# Altium schematic sheet Amplify.SchDoc
size A4; SheetNumber: 2; SheetTotal: 5
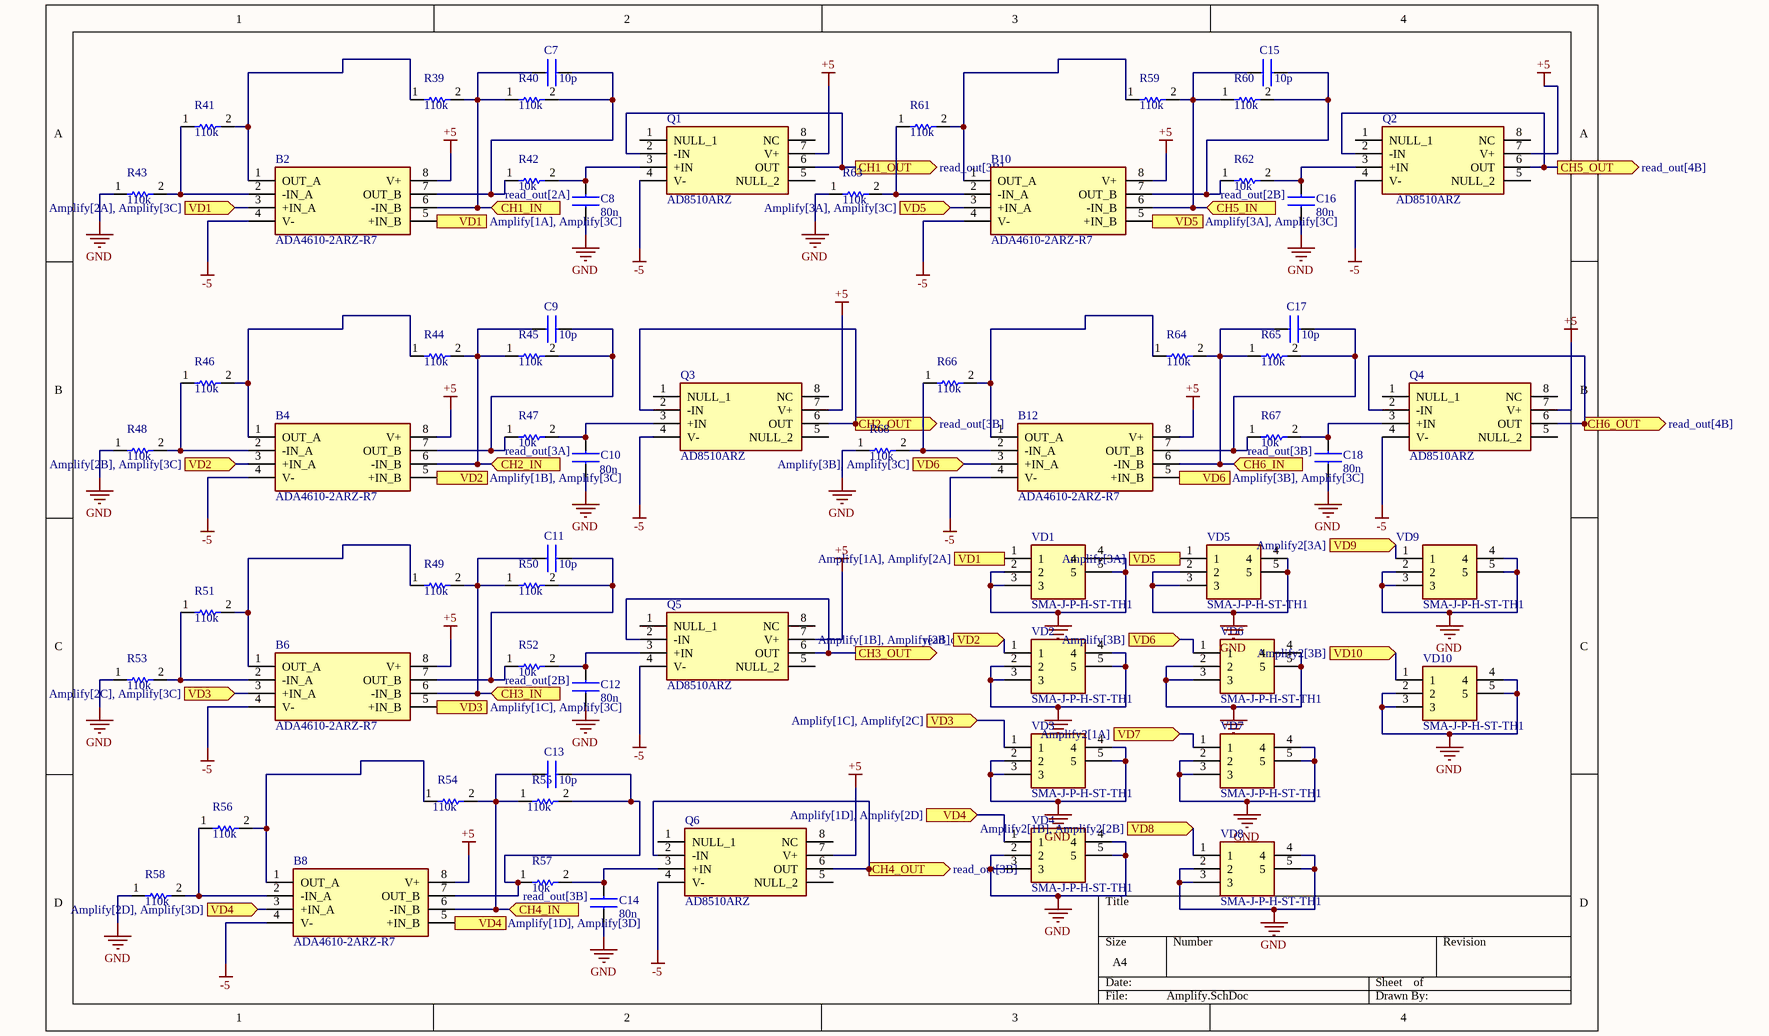
[diagram p0: Amplify.SchDoc]

## Parts
B2  ADA4610-2ARZ-R7  [SOIC127P600X175-8N]
B4  ADA4610-2ARZ-R7  [SOIC127P600X175-8N]
B6  ADA4610-2ARZ-R7  [SOIC127P600X175-8N]
B8  ADA4610-2ARZ-R7  [SOIC127P600X175-8N]
B10  ADA4610-2ARZ-R7  [SOIC127P600X175-8N]
B12  ADA4610-2ARZ-R7  [SOIC127P600X175-8N]
C7  10p  [0805X7R106KT1AT]
C8  80n  [0805X7R106KT1AT]
C9  10p  [0805X7R106KT1AT]
C10  80n  [0805X7R106KT1AT]
C11  10p  [0805X7R106KT1AT]
C12  80n  [0805X7R106KT1AT]
C13  10p  [0805X7R106KT1AT]
C14  80n  [0805X7R106KT1AT]
C15  10p  [0805X7R106KT1AT]
C16  80n  [0805X7R106KT1AT]
C17  10p  [0805X7R106KT1AT]
C18  80n  [0805X7R106KT1AT]
Q1  AD8510ARZ  [AD8510ARZ]
Q2  AD8510ARZ  [AD8510ARZ]
Q3  AD8510ARZ  [AD8510ARZ]
Q4  AD8510ARZ  [AD8510ARZ]
Q5  AD8510ARZ  [AD8510ARZ]
Q6  AD8510ARZ  [AD8510ARZ]
R39  110k  [CR0805-FX-1543ELF]
R40  110k  [CR0805-FX-1543ELF]
R41  110k  [CR0805-FX-1543ELF]
R42  10k  [CR0805-FX-1543ELF]
R43  110k  [CR0805-FX-1543ELF]
R44  110k  [CR0805-FX-1543ELF]
R45  110k  [CR0805-FX-1543ELF]
R46  110k  [CR0805-FX-1543ELF]
R47  10k  [CR0805-FX-1543ELF]
R48  110k  [CR0805-FX-1543ELF]
R49  110k  [CR0805-FX-1543ELF]
R50  110k  [CR0805-FX-1543ELF]
R51  110k  [CR0805-FX-1543ELF]
R52  10k  [CR0805-FX-1543ELF]
R53  110k  [CR0805-FX-1543ELF]
R54  110k  [CR0805-FX-1543ELF]
R55  110k  [CR0805-FX-1543ELF]
R56  110k  [CR0805-FX-1543ELF]
R57  10k  [CR0805-FX-1543ELF]
R58  110k  [CR0805-FX-1543ELF]
R59  110k  [CR0805-FX-1543ELF]
R60  110k  [CR0805-FX-1543ELF]
R61  110k  [CR0805-FX-1543ELF]
R62  10k  [CR0805-FX-1543ELF]
R63  110k  [CR0805-FX-1543ELF]
R64  110k  [CR0805-FX-1543ELF]
R65  110k  [CR0805-FX-1543ELF]
R66  110k  [CR0805-FX-1543ELF]
R67  10k  [CR0805-FX-1543ELF]
R68  110k  [CR0805-FX-1543ELF]
VD1  SMA-J-P-H-ST-TH1  [SMAJPHSTTH1]
VD2  SMA-J-P-H-ST-TH1  [SMAJPHSTTH1]
VD3  SMA-J-P-H-ST-TH1  [SMAJPHSTTH1]
VD4  SMA-J-P-H-ST-TH1  [SMAJPHSTTH1]
VD5  SMA-J-P-H-ST-TH1  [SMAJPHSTTH1]
VD6  SMA-J-P-H-ST-TH1  [SMAJPHSTTH1]
VD7  SMA-J-P-H-ST-TH1  [SMAJPHSTTH1]
VD8  SMA-J-P-H-ST-TH1  [SMAJPHSTTH1]
VD9  SMA-J-P-H-ST-TH1  [SMAJPHSTTH1]
VD10  SMA-J-P-H-ST-TH1  [SMAJPHSTTH1]

## Ports
CH1_IN (in, see read_out[2A]), CH1_OUT (out, see read_out[3B]), CH2_IN (in, see read_out[3A]), CH2_OUT (out, see read_out[3B]), CH3_IN (in, see read_out[2B]), CH3_OUT (out, see read_out[3B]), CH4_IN (in, see read_out[3B]), CH4_OUT (out, see read_out[3B]), CH5_IN (in, see read_out[2B]), CH5_OUT (out, see read_out[4B]), CH6_IN (in, see read_out[3B]), CH6_OUT (out, see read_out[4B]), VD1 (in, see Amplify[1A], Amplify[2A]), VD1 (in, see Amplify[1A], Amplify[3C]), VD1 (in, see Amplify[2A], Amplify[3C]), VD2 (in, see Amplify[1B], Amplify[2B]), VD2 (in, see Amplify[1B], Amplify[3C]), VD2 (in, see Amplify[2B], Amplify[3C]), VD3 (in, see Amplify[1C], Amplify[2C]), VD3 (in, see Amplify[1C], Amplify[3C]), VD3 (in, see Amplify[2C], Amplify[3C]), VD4 (in, see Amplify[1D], Amplify[2D]), VD4 (in, see Amplify[1D], Amplify[3D]), VD4 (in, see Amplify[2D], Amplify[3D]), VD5 (in, see Amplify[3A]), VD5 (in, see Amplify[3A], Amplify[3C]), VD6 (in, see Amplify[3B]), VD6 (in, see Amplify[3B], Amplify[3C]), VD7 (in, see Amplify2[1A]), VD8 (in, see Amplify2[1B], Amplify2[2B]), VD9 (in, see Amplify2[3A]), VD10 (in, see Amplify2[3B])

## Nets
+5: B2.8(V+) B4.8(V+) B6.8(V+) B8.8(V+) B10.8(V+) B12.8(V+) Q1.7(V+) Q2.7(V+) Q3.7(V+) Q4.7(V+) Q5.7(V+) Q6.7(V+)
-5: B2.4(V-) B4.4(V-) B6.4(V-) B8.4(V-) B10.4(V-) B12.4(V-) Q1.4(V-) Q2.4(V-) Q3.4(V-) Q4.4(V-) Q5.4(V-) Q6.4(V-)
GND: C8.2 C10.2 C12.2 C14.2 C16.2 C18.2 R43.1 R48.1 R53.1 R58.1 R63.1 R68.1 VD1.2 VD1.3 VD1.4 VD1.5 VD2.2 VD2.3 VD2.4 VD2.5 VD3.2 VD3.3 VD3.4 VD3.5 VD4.2 VD4.3 VD4.4 VD4.5 VD5.2 VD5.3 VD5.4 VD5.5 VD6.2 VD6.3 VD6.4 VD6.5 VD7.2 VD7.3 VD7.4 VD7.5 VD8.2 VD8.3 VD8.4 VD8.5 VD9.2 VD9.3 VD9.4 VD9.5 VD10.2 VD10.3 VD10.4 VD10.5
CH1_IN: B2.6(-IN_B) C7.1 R39.2 R40.1 ; port CH1_IN
CH1_OUT: Q1.2(-IN) Q1.6(OUT) ; port CH1_OUT
CH2_IN: B4.6(-IN_B) C9.1 R44.2 R45.1 ; port CH2_IN
CH2_OUT: Q3.2(-IN) Q3.6(OUT) ; port CH2_OUT
CH3_IN: B6.6(-IN_B) C11.1 R49.2 R50.1 ; port CH3_IN
CH3_OUT: Q5.2(-IN) Q5.6(OUT) ; port CH3_OUT
CH4_IN: B8.6(-IN_B) C13.1 R54.2 R55.1 ; port CH4_IN
CH4_OUT: Q6.2(-IN) Q6.6(OUT) ; port CH4_OUT
CH5_IN: B10.6(-IN_B) C15.1 R59.2 R60.1 ; port CH5_IN
CH5_OUT: Q2.2(-IN) Q2.6(OUT) ; port CH5_OUT
CH6_IN: B12.6(-IN_B) C17.1 R64.2 R65.1 ; port CH6_IN
CH6_OUT: Q4.2(-IN) Q4.6(OUT) ; port CH6_OUT
VD1: B2.3(+IN_A) B2.5(+IN_B) VD1.1 ; port VD1
VD2: B4.3(+IN_A) B4.5(+IN_B) VD2.1 ; port VD2
VD3: B6.3(+IN_A) B6.5(+IN_B) VD3.1 ; port VD3
VD4: B8.3(+IN_A) B8.5(+IN_B) VD4.1 ; port VD4
VD5: B10.3(+IN_A) B10.5(+IN_B) VD5.1 ; port VD5
VD6: B12.3(+IN_A) B12.5(+IN_B) VD6.1 ; port VD6
VD7: VD7.1 ; port VD7
VD8: VD8.1 ; port VD8
VD9: VD9.1 ; port VD9
VD10: VD10.1 ; port VD10
NetB2_1: B2.1(OUT_A) R39.1 R41.2
NetB2_2: B2.2(-IN_A) R41.1 R43.2
NetB2_7: B2.7(OUT_B) C7.2 R40.2 R42.1
NetB4_1: B4.1(OUT_A) R44.1 R46.2
NetB4_2: B4.2(-IN_A) R46.1 R48.2
NetB4_7: B4.7(OUT_B) C9.2 R45.2 R47.1
NetB6_1: B6.1(OUT_A) R49.1 R51.2
NetB6_2: B6.2(-IN_A) R51.1 R53.2
NetB6_7: B6.7(OUT_B) C11.2 R50.2 R52.1
NetB8_1: B8.1(OUT_A) R54.1 R56.2
NetB8_2: B8.2(-IN_A) R56.1 R58.2
NetB8_7: B8.7(OUT_B) C13.2 R55.2 R57.1
NetB10_1: B10.1(OUT_A) R59.1 R61.2
NetB10_2: B10.2(-IN_A) R61.1 R63.2
NetB10_7: B10.7(OUT_B) C15.2 R60.2 R62.1
NetB12_1: B12.1(OUT_A) R64.1 R66.2
NetB12_2: B12.2(-IN_A) R66.1 R68.2
NetB12_7: B12.7(OUT_B) C17.2 R65.2 R67.1
NetC8_1: C8.1 Q1.3(+IN) R42.2
NetC10_1: C10.1 Q3.3(+IN) R47.2
NetC12_1: C12.1 Q5.3(+IN) R52.2
NetC14_1: C14.1 Q6.3(+IN) R57.2
NetC16_1: C16.1 Q2.3(+IN) R62.2
NetC18_1: C18.1 Q4.3(+IN) R67.2

Not connected (* = marked no-connect by the designer): Q1 1(NULL_1) 5(NULL_2) 8(NC); Q2 1(NULL_1) 5(NULL_2) 8(NC); Q3 1(NULL_1) 5(NULL_2) 8(NC); Q4 1(NULL_1) 5(NULL_2) 8(NC); Q5 1(NULL_1) 5(NULL_2) 8(NC); Q6 1(NULL_1) 5(NULL_2) 8(NC)

## Library data of the parts
B2 B4 B6 B8 B10 B12 = ADA4610-2ARZ-R7: Low Noise, Precision, Rail-to-Rail Output, JFET Dual Op Amp +/-5 V to +/-15 V 40C to +125C; Manufacturer_Name: Analog Devices; Geometry.Height: 1.75mm; Mouser Part Number: 584-ADA4610-2ARZ-R7; Mouser Price/Stock: https://www.mouser.co.uk/ProductDetail/Analog-Devices/ADA4610-2ARZ-R7?qs=BpaRKvA4VqEBfMREioRxEg%3D%3D; Manufacturer_Part_Number: ADA4610-2ARZ-R7; Datasheet Link: https://www.analog.com/ADA4610-2/datasheet
C7-C18 = capacitor
R39-R68 = resistor
VD1-VD10 = SMA-J-P-H-ST-TH1: SAMTEC - SMA-J-P-H-ST-TH1 - RF COAXIAL, SMA JACK, 50 OHM, PCB; Geometry.Height: 9.55mm; Mouser Part Number: 200-SMAJPHSTTH1; Mouser Price/Stock: https://www.mouser.co.uk/ProductDetail/Samtec/SMA-J-P-H-ST-TH1?qs=bkXRl3BLxbHdaAB2Qwy6zw%3D%3D; Manufacturer_Name: SAMTEC; Manufacturer_Part_Number: SMA-J-P-H-ST-TH1; Datasheet Link: http://suddendocs.samtec.com/prints/sma-j-p-x-st-th1-mkt.pdf